# Altium project RM_OLED&BUTTON.PrjPcb
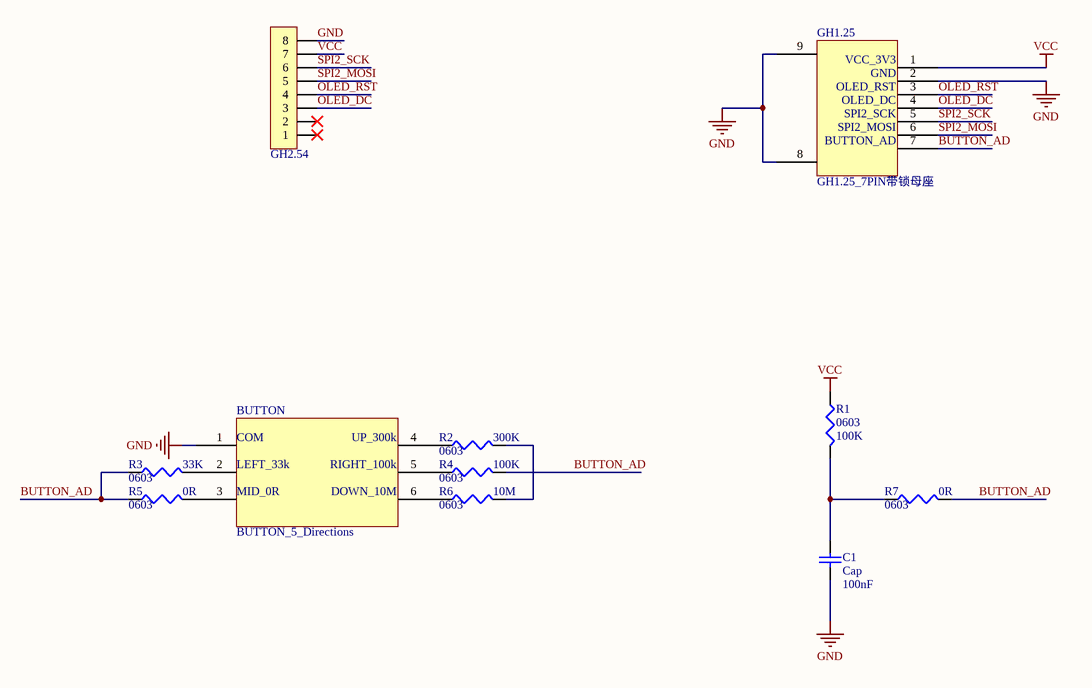
[diagram p0: Button_Sheet.SchDoc]
1 sheet, 11 parts. Net scope: global (net labels, ports and power ports of the same name join across sheets).
Board file: Button_PCB.PcbDoc

## Sheet Button_Sheet.SchDoc
size A4; SheetNumber: 1; SheetTotal: 1

### Parts
BUTTON  BUTTON_5_Directions  [PCBComponent_1]
C1  Cap  value 100nF  [0603]
GH1.25  GH1.25_7PIN带锁母座  [GH1.25-WS-7P]
GH2.54  HDR-1X8  [HDR2.54-M-LI-8P]  (value not drawn)
R1  0603  value 100K  [J1-0603]
R2  0603  value 300K  [J1-0603]
R3  0603  value 33K  [J1-0603]
R4  0603  value 100K  [J1-0603]
R5  0603  value 0R  [J1-0603]
R6  0603  value 10M  [J1-0603]
R7  0603  value 0R  [J1-0603]

### Nets
GND: BUTTON.1 C1.2 GH1.25.2 GH1.25.8 GH1.25.9 GH2.54.8
VCC: GH1.25.1 GH2.54.7 R1.1
BUTTON_AD: GH1.25.7 R3.1 R4.2 R5.1 R7.2
OLED_DC: GH1.25.4 GH2.54.3
OLED_RST: GH1.25.3 GH2.54.4
SPI2_MOSI: GH1.25.6 GH2.54.5
SPI2_SCK: GH1.25.5 GH2.54.6
NetBUTTON_2: BUTTON.2 R3.2
NetBUTTON_3: BUTTON.3 R5.2
NetBUTTON_4: BUTTON.4 R2.1
NetBUTTON_5: BUTTON.5 R4.1
NetBUTTON_6: BUTTON.6 R6.1
NetC1_1: C1.1 R1.2 R7.1
NetR2_2: R2.2 R6.2

Not connected (* = marked no-connect by the designer): GH2.54 1* 2*

### Notes on the sheet
- (in symbol BUTTON_5_Directions) COM; UP_300k; LEFT_33k; RIGHT_100k; MID_0R; DOWN_10M
- (in symbol GH1.25_7PIN带锁母座) VCC_3V3; GND; OLED_RST; OLED_DC; SPI2_SCK; SPI2_MOSI; BUTTON_AD

### Library data of the parts
C1 = Cap: Capacitor; Published: 8-Jun-2000; LatestRevisionDate: 17-Jul-2002; LatestRevisionNote: Re-released for DXP Platform.; PackageReference: RAD-0.3; Publisher: Altium Limited; PackageDescription: Radial Cap, Thru-Hole; 2 Leads; 0.3 in Pin Spacing
GH2.54 = Header 8: 8P接插件; 淘宝ID: 小糖豆的小窝窝; BOM名称: 8P接插件; 下单链接: https://item.taobao.com/item.htm?ft=t&id=613637044352
R1-R7 = Res3: Resistor; Published: 8-Jun-2000; LatestRevisionDate: 29-May-2009; LatestRevisionNote: IPC-7351 Footprint Added.; PackageReference: J1-0603; Publisher: Altium Limited; PackageDescription: Chip Resistor